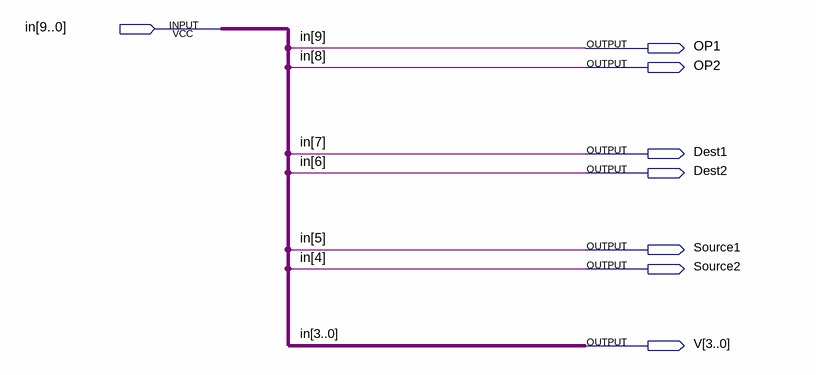
[diagram p0: schematic sheet]
// Quartus schematic Decoder.bdf as structural Verilog: 0 symbols, 8 pins
module Decoder (
  input  [9:0] in,
  output OP1,
  output OP2,
  output Dest1,
  output Dest2,
  output Source1,
  output Source2,
  output [3:0] V
);


  assign Dest1 = in[7];
  assign Dest2 = in[6];
  assign OP1 = in[9];
  assign OP2 = in[8];
  assign Source1 = in[5];
  assign Source2 = in[4];
  assign V = in[3:0];
endmodule
